# Altium schematic sheet mainboard_mcu.v1.3.SchDoc
size A3
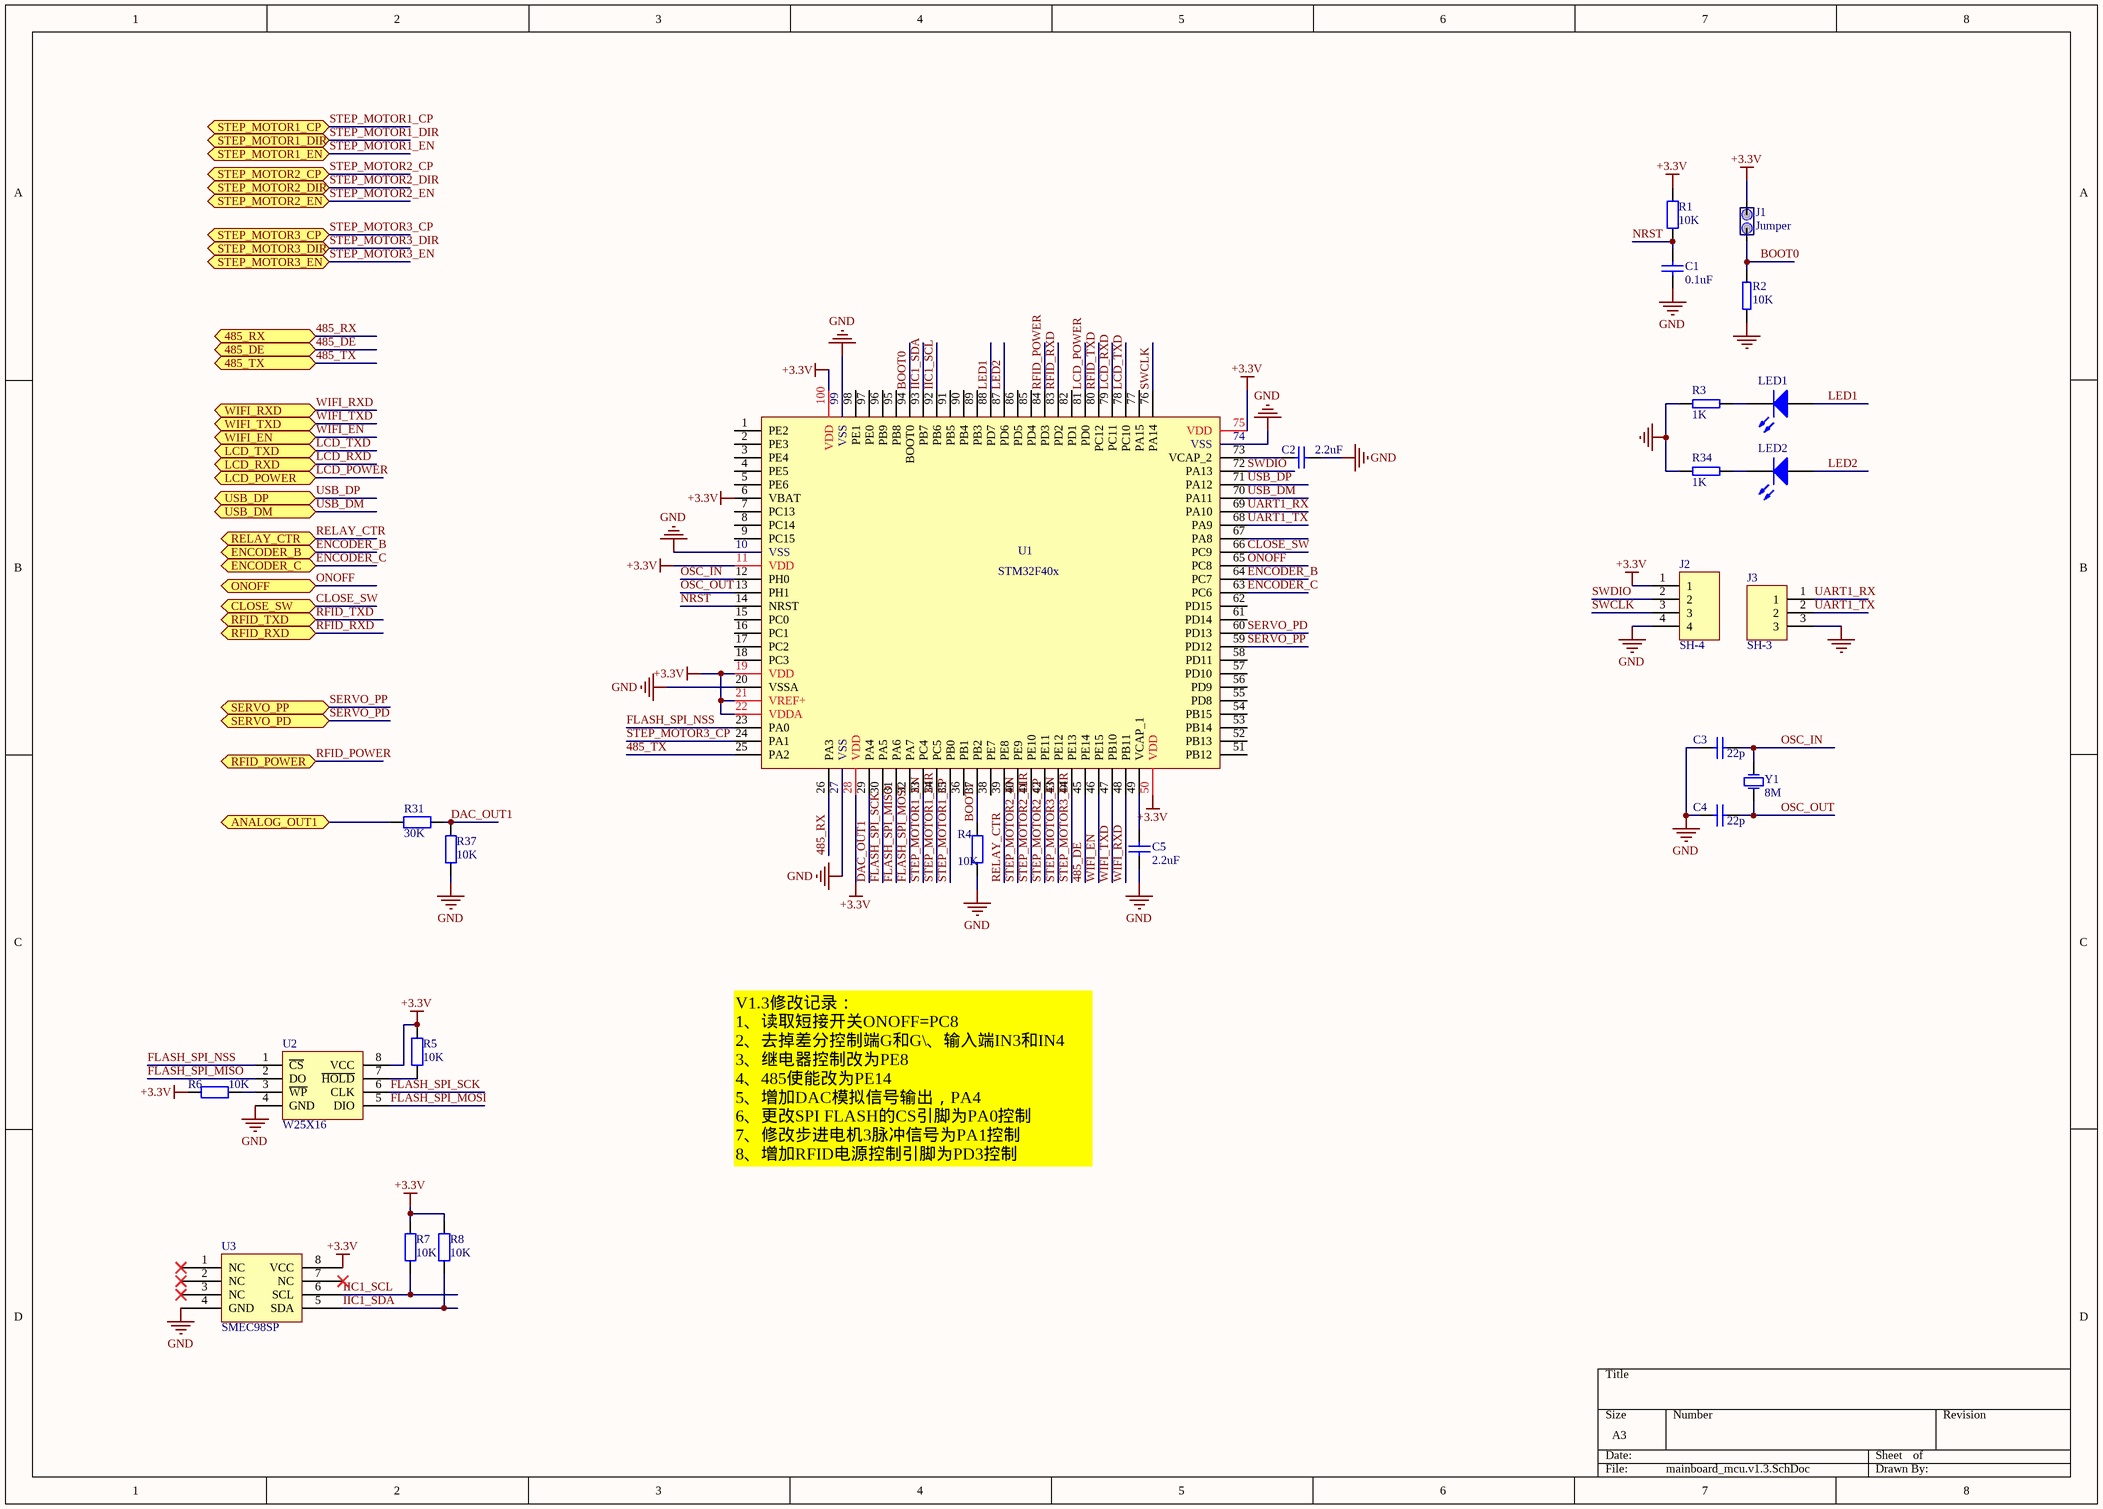
[diagram p0: mainboard_mcu.v1.3.SchDoc]

## Parts
C1  0.1uF  [0805]
C2  2.2uF  [0805]
C3  22p  [0805]
C4  22p  [0805]
C5  2.2uF  [0805]
J1  Jumper  [J254-2]
J2  SH-4  [J254-4]
J3  SH-3  [J2.54-3]
LED1  GREEN  [LED]  (value not drawn)
LED2  GREEN  [LED]  (value not drawn)
R1  10K  [0805]
R2  10K  [0805]
R3  1K  [0805]
R4  10K  [0805]
R5  10K  [0805]
R6  10K  [0805]
R7  10K  [0805]
R8  10K  [0805]
R31  30K  [0805]
R34  1K  [0805]
R37  10K  [0805]
U1  STM32F40x  [TQFP100]
U2  W25X16  [SOP8]
U3  SMEC98SP  [SO-8]
Y1  8M  [XTAL]

## Ports
485_DE, 485_RX, 485_TX, ANALOG_OUT1, CLOSE_SW, ENCODER_B, ENCODER_C, LCD_POWER, LCD_RXD, LCD_TXD, ONOFF, RELAY_CTR, RFID_POWER, RFID_RXD, RFID_TXD, SERVO_PD, SERVO_PP, STEP_MOTOR1_CP, STEP_MOTOR1_DIR, STEP_MOTOR1_EN, STEP_MOTOR2_CP, STEP_MOTOR2_DIR, STEP_MOTOR2_EN, STEP_MOTOR3_CP, STEP_MOTOR3_DIR, STEP_MOTOR3_EN, USB_DM, USB_DP, WIFI_EN, WIFI_RXD, WIFI_TXD

## Nets
+3.3V: J1.2 J2.1 R1.2 R5.1 R6.2 R7.2 R8.2 U1.6(VBAT) U1.11(VDD) U1.19(VDD) U1.21(VREF+) U1.22(VDDA) U1.28(VDD) U1.50(VDD) U1.75(VDD) U1.100(VDD) U2.8(VCC) U3.8(VCC)
GND: C1.1 C2.1 C3.2 C4.2 C5.2 J2.4 J3.3 R2.2 R3.2 R4.2 R34.2 R37.1 U1.10(VSS) U1.20(VSSA) U1.27(VSS) U1.74(VSS) U1.99(VSS) U2.4(GND) U3.4(GND)
485_DE: U1.45(PE14) ; port 485_DE
485_RX: U1.26(PA3) ; port 485_RX
485_TX: U1.25(PA2) ; port 485_TX
ANALOG_OUT1: R31.1 ; port ANALOG_OUT1
BOOT0: J1.1 R2.1 U1.94(BOOT0)
BOOT1: R4.1 U1.37(PB2)
CLOSE_SW: U1.66(PC9) ; port CLOSE_SW
DAC_OUT1: R31.2 R37.2 U1.29(PA4)
ENCODER_B: U1.64(PC7) ; port ENCODER_B
ENCODER_C: U1.63(PC6) ; port ENCODER_C
FLASH_SPI_MISO: U1.31(PA6) U2.2(DO)
FLASH_SPI_MOSI: U1.32(PA7) U2.5(DIO)
FLASH_SPI_NSS: U1.23(PA0) U2.1(~{CS})
FLASH_SPI_SCK: U1.30(PA5) U2.6(CLK)
IIC1_SCL: R7.1 U1.92(PB6) U3.6(SCL)
IIC1_SDA: R8.1 U1.93(PB7) U3.5(SDA)
LCD_POWER: U1.81(PD0) ; port LCD_POWER
LCD_RXD: U1.79(PC11) ; port LCD_RXD
LCD_TXD: U1.78(PC10) ; port LCD_TXD
LED1: LED1.1(A) U1.88(PD7)
LED2: LED2.1(A) U1.87(PD6)
NRST: C1.2 R1.1 U1.14(NRST)
ONOFF: U1.65(PC8) ; port ONOFF
OSC_IN: C3.1 U1.12(PH0) Y1.2(OSC2)
OSC_OUT: C4.1 U1.13(PH1) Y1.1(OSC1)
RELAY_CTR: U1.39(PE8) ; port RELAY_CTR
RFID_POWER: U1.84(PD3) ; port RFID_POWER
RFID_RXD: U1.83(PD2) ; port RFID_RXD
RFID_TXD: U1.80(PC12) ; port RFID_TXD
SERVO_PD: U1.60(PD13) ; port SERVO_PD
SERVO_PP: U1.59(PD12) ; port SERVO_PP
STEP_MOTOR1_CP: U1.35(PB0) ; port STEP_MOTOR1_CP
STEP_MOTOR1_DIR: U1.34(PC5) ; port STEP_MOTOR1_DIR
STEP_MOTOR1_EN: U1.33(PC4) ; port STEP_MOTOR1_EN
STEP_MOTOR2_CP: U1.42(PE11) ; port STEP_MOTOR2_CP
STEP_MOTOR2_DIR: U1.41(PE10) ; port STEP_MOTOR2_DIR
STEP_MOTOR2_EN: U1.40(PE9) ; port STEP_MOTOR2_EN
STEP_MOTOR3_CP: U1.24(PA1) ; port STEP_MOTOR3_CP
STEP_MOTOR3_DIR: U1.44(PE13) ; port STEP_MOTOR3_DIR
STEP_MOTOR3_EN: U1.43(PE12) ; port STEP_MOTOR3_EN
SWCLK: J2.3 U1.76(PA14)
SWDIO: J2.2 U1.72(PA13)
UART1_RX: J3.1 U1.69(PA10)
UART1_TX: J3.2 U1.68(PA9)
USB_DM: U1.70(PA11) ; port USB_DM
USB_DP: U1.71(PA12) ; port USB_DP
WIFI_EN: U1.46(PE15) ; port WIFI_EN
WIFI_RXD: U1.48(PB11) ; port WIFI_RXD
WIFI_TXD: U1.47(PB10) ; port WIFI_TXD
NetC2_2: C2.2 U1.73(VCAP_2)
NetC5_1: C5.1 U1.49(VCAP_1)
NetLED1_2: LED1.2(K) R3.1
NetLED2_2: LED2.2(K) R34.1
NetR5_2: R5.2 U2.7(~{HOLD})
NetR6_1: R6.1 U2.3(~{WP})

Not connected (* = marked no-connect by the designer): U1 1(PE2) 2(PE3) 3(PE4) 4(PE5) 5(PE6) 7(PC13) 8(PC14) 9(PC15) 15(PC0) 16(PC1) 17(PC2) 18(PC3) 36(PB1) 38(PE7) 51(PB12) 52(PB13) 53(PB14) 54(PB15) 55(PD8) 56(PD9) 57(PD10) 58(PD11) 61(PD14) 62(PD15) 67(PA8) 77(PA15) 82(PD1) 85(PD4) 86(PD5) 89(PB3) 90(PB4) 91(PB5) 95(PB8) 96(PB9) 97(PE0) 98(PE1); U3 1(NC)* 2(NC)* 3(NC)* 7(NC)*

## Notes on the sheet
- V1.3修改记录：
  1、读取短接开关ONOFF=PC8
  2、去掉差分控制端G和G\、输入端IN3和IN4
  3、继电器控制改为PE8
  4、485使能改为PE14
  5、增加DAC模拟信号输出，PA4
  6、更改SPI FLASH的CS引脚为PA0控制
  7、修改步进电机3脉冲信号为PA1控制
  8、增加RFID电源控制引脚为PD3控制

## Library data of the parts
C1-C5 = Cap: Capacitor; Value: 100pF; Published: 8-Jun-2000; LatestRevisionDate: 17-Jul-2002; LatestRevisionNote: Re-released for DXP Platform.; PackageReference: RAD-0.3; Publisher: Altium Limited
LED1 LED2 = LED2: Typical RED, GREEN, YELLOW, AMBER GaAs LED; Published: 8-Jun-2000; Revision: July-2002: Re-released for DXP Platform.; Publisher: Altium Limited
R1 R4-R8 R31 R37 = Res2: Resistor; Value: 1K; Published: 8-Jun-2000; LatestRevisionDate: 17-Jul-2002; LatestRevisionNote: Re-released for DXP Platform.; PackageReference: AXIAL-0.4; Publisher: Altium Limited
R2 R3 R34 = RES: 电阻
Y1 = X-32.768: Crystal Oscillator; Published: 8-Jun-2000; LatestRevisionDate: 17-Jul-2002; LatestRevisionNote: Re-released for DXP Platform.; PackageReference: R38; Publisher: Altium Limited